# Altium schematic sheet LEDs.SchDoc: Binary to DEC/HEX/BCD/U2/U1
size A4; DrawnBy: Jakub Kajzer; Revision: 1.0; SheetNumber: 2; SheetTotal: 3
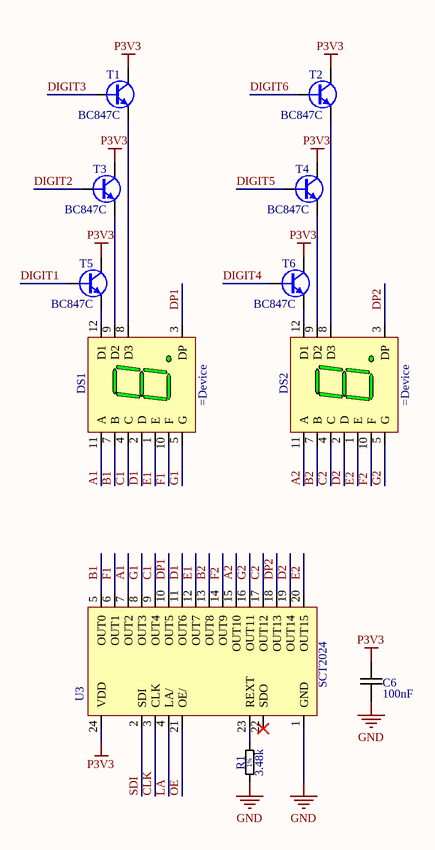
[diagram p0: LEDs.SchDoc]

## Parts
C6  100nF  [CAPC0402X60N]
DS1  (no value)  [7seg_3digits]
DS2  (no value)  [7seg_3digits]
R1  3.48k  [RESC0402X40N]
T1  BC847C  [SOT23-3]
T2  BC847C  [SOT23-3]
T3  BC847C  [SOT23-3]
T4  BC847C  [SOT23-3]
T5  BC847C  [SOT23-3]
T6  BC847C  [SOT23-3]
U3  SCT2024  [SOP-24_N]

## Nets
GND: C6.1 R1.1 U3.1(GND)
P3V3: C6.2 T1.3(C) T2.3(C) T3.3(C) T4.3(C) T5.3(C) T6.3(C) U3.24(VDD)
A1: DS1.11(A) U3.7(OUT2)
A2: DS2.11(A) U3.15(OUT10)
B1: DS1.7(B) U3.5(OUT0)
B2: DS2.7(B) U3.13(OUT8)
C1: DS1.4(C) U3.9(OUT4)
C2: DS2.4(C) U3.17(OUT12)
CLK: U3.3(CLK)
D1: DS1.2(D) U3.11(OUT6)
D2: DS2.2(D) U3.19(OUT14)
DIGIT1: T5.1(B)
DIGIT2: T3.1(B)
DIGIT3: T1.1(B)
DIGIT4: T6.1(B)
DIGIT5: T4.1(B)
DIGIT6: T2.1(B)
DP1: DS1.3(DP) U3.10(OUT5)
DP2: DS2.3(DP) U3.18(OUT13)
E1: DS1.1(E) U3.12(OUT7)
E2: DS2.1(E) U3.20(OUT15)
F1: DS1.10(F) U3.6(OUT1)
F2: DS2.10(F) U3.14(OUT9)
G1: DS1.5(G) U3.8(OUT3)
G2: DS2.5(G) U3.16(OUT11)
LA: U3.4(LA/)
OE: U3.21(OE/)
SDI: U3.2(SDI)
NetDS1_8: DS1.8(D3) T1.2(E)
NetDS1_9: DS1.9(D2) T3.2(E)
NetDS1_12: DS1.12(D1) T5.2(E)
NetDS2_8: DS2.8(D3) T2.2(E)
NetDS2_9: DS2.9(D2) T4.2(E)
NetDS2_12: DS2.12(D1) T6.2(E)
NetR1_2: R1.2 U3.23(REXT)

Not connected (* = marked no-connect by the designer): U3 22(SDO)*

## Library data of the parts
C6 = CC0402_100NF_16V_10%_X7R: Non-polarised capacitor; Manufacturer: GENERIC; Manufacturer 1 Example: Samsung; Manufacturer 1 Part Number: CL05B104KO5NNNC; Manufacturer 1 Component Height: 0.5mm; PressFit: No; Dielectric: X7R; Tolerance: 10%; Voltage: 16V; DesignItemId: CC0402_100NF_16V_10%_X7R; Author: KB; Case: 0402 (1005 metric); Component Kind: Standard; HelpURL: http://www.farnell.com/datasheets/1870456.pdf?_ga=2.66904750.1666480506.1564307475-778048469.1556931874&_gac=1.242951606.1563147047.EAIaIQobChMIrfuAvMi14wIVB-J3Ch1XegfpEAYYASABEgIMVfD_BwE; Manufacturer Part Number: CC0402_100NF_16V_10%_X7R; Mounted: Yes; Part Description: Non-polarised capacitor; Pin Count: 2; Sense: No; SMD: Yes; Socket: No; Status: Recommended; Value: 100nF; Supplier 1: TME; Supplier 2: Farnell; Supplier 3: Mouser; Create Date: 29.07.2019; LatestRevisionDate: 29.07.2019; Supplier Part Number 1: CL05B104KO5NNNC; Supplier Part Number 2: 1758896; Supplier Part Number 3: 710-885012205037
DS1 DS2 = 7-Segment Green Display CA 3-Digits: 7-seg LED Display; 9.14mm; 0.36ˇ¨; 3 Digits; Green; Manufacturer: Generic; Manufacturer 1 Example: WENRUN; Manufacturer 1 Part Number: LTD036BAG-101A-02; Manufacturer 1 Component Height: 7.2mm; PressFit: No; DesignItemId: 7-Segment Green Display CA 3-Digits; Author: JK; Color: Green; Component Kind: Standard; HelpURL: https://www.tme.eu/Document/a6075032405c075918ac13897b6973d4/LTD036BAG-101A.pdf; Mounted: YES; Part Description: 7-seg LED Display; 9.14mm; 0.36ˇ¨; 3 Digits; Green; Pin Count: 12; Sense: No; SMD: No; Socket: No; Supplier 1: TME; Create Date: 04.12.2019; LatestRevisionDate: 04.12.2019; Supplier Part Number 1: LTD036BAG-101A
R1 = R0402_3K48_0.0625W_100PPM: General Purpose Thick Film Chip Resistor; Manufacturer: GENERIC; Manufacturer Part Number: R0402_3K48_0.0625W 0.1W 0.125W 0.25W 0.5W 1W 0.75W 1W_100PPM; Manufacturer 1 Example: Vishay; Manufacturer 1 Part Number: CRCW04023K48FKEDC; Manufacturer 1 Component Height: 0.4mm; Power: 62.5mW; Current Max: 0; PressFit: No; TC: ±100 ppm/°C; Tolerance: 1%; Voltage: 50V; DesignItemId: R0402_3K48_0.0625W_100PPM; Author: KB; Case: 0402 (1005 metric); Component Kind: Standard; Component Type: Standard; HelpURL: https://www.vishay.com/docs/20035/dcrcwe3.pdf; Mounted: Yes; Part Description: General Purpose Thick Film Chip Resistor; Pin Count: 2; Sense: No; SMD: Yes; Socket: No; Status: Recommended; Value: 3.48k; Supplier 1: Farnell; Supplier 2: TME; Supplier 3: Mouser; Create Date: 03.07.2019; LatestRevisionDate: 03.07.2019; Alt_Comment: 3.48k
T1-T6 = BC847C: NPN Bipolar Transistor, 45V, 100mA, 250mW, SOT23; Manufacturer 1 Example: Nexperia; Manufacturer 1 Part Number: BC847C.215; Manufacturer 1 Component Height: 1.05mm; PressFit: No; DesignItemId: BC847C; Author: KB; Device: BC847C; Component Kind: Standard; HelpURL: https://assets.nexperia.com/documents/data-sheet/BC847_SER.pdf; Mounted: Yes; Part Description: NPN Bipolar Transistor, 45V, 100mA, 250mW, SOT23; Pin Count: 3; Sense: No; SMD: Yes; Socket: No; Supplier 1: TME; Supplier 2: Farnell; Supplier 3: Mouser; Create Date: 19.04.2009; LatestRevisionDate: 19.04.2009; Supplier Part Number 1: BC847C.215; Supplier Part Number 2: 1081235; Supplier Part Number 3: 771-BC847C-T/R
U3 = SCT2024: Driver, kontroler LED, 5ˇĹ0mA, Kanały: 16, 3ˇĹ,5V, SOP24; Manufacturer: Generic; Manufacturer 1 Example: STARCHIPS TECHNOLOGY; Manufacturer 1 Part Number: SCT2024CSOG; Manufacturer 1 Component Height: 2.65mm; PressFit: No; DesignItemId: SCT2024; Author: UN; Component Kind: Standard; HelpURL: https://www.tme.eu/Document/8876e3da3e0cc25d8b4c7cdeea8b8a88/SCT2024.pdf; Mounted: Yes; Part Description: Driver, kontroler LED, 5ˇĹ0mA, Kanały: 16, 3ˇĹ,5V, SOP24; Pin Count: 24; Sense: No; SMD: Yes; Socket: No; Supplier 1: TME; Create Date: 14.08.2019; LatestRevisionDate: 14.08.2019; Supplier Part Number 1: SCT2024CSOG